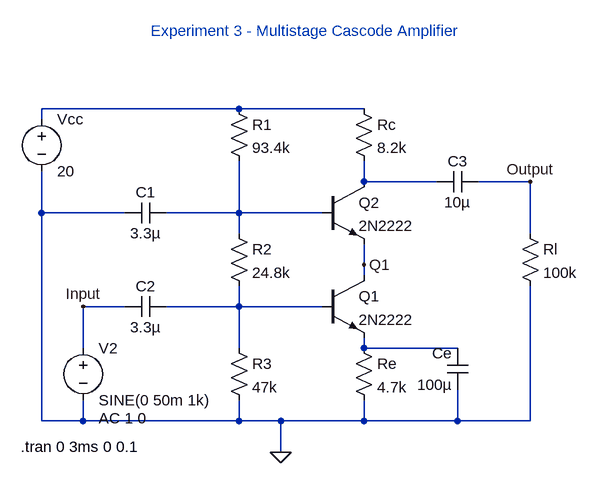
[diagram p0: schematic Experiment 3 - Multistage Cascode Amplifier.asc]
Experiment 3 - Multistage Cascode Amplifier.asc, the LTspice schematic file:
Version 4
SHEET 1 880 680
WIRE 64 -16 -240 -16
WIRE 256 -16 64 -16
WIRE -240 0 -240 -16
WIRE 256 96 256 64
WIRE 368 96 256 96
WIRE 512 96 432 96
WIRE -240 144 -240 80
WIRE -112 144 -240 144
WIRE 64 144 64 64
WIRE 64 144 -48 144
WIRE 192 144 64 144
WIRE 64 176 64 144
WIRE 512 176 512 96
WIRE 256 224 256 192
WIRE 256 240 256 224
WIRE -112 288 -176 288
WIRE 64 288 64 256
WIRE 64 288 -48 288
WIRE 192 288 64 288
WIRE -176 352 -176 288
WIRE 64 352 64 288
WIRE 256 352 256 336
WIRE 400 352 256 352
WIRE -240 464 -240 144
WIRE -176 464 -176 432
WIRE -176 464 -240 464
WIRE 64 464 64 432
WIRE 64 464 -176 464
WIRE 128 464 64 464
WIRE 256 464 256 432
WIRE 256 464 128 464
WIRE 400 464 400 416
WIRE 400 464 256 464
WIRE 512 464 512 256
WIRE 512 464 400 464
WIRE 128 512 128 464
FLAG 128 512 0
FLAG 512 96 Output
FLAG 256 224 Q1
FLAG -176 288 Input
SYMBOL npn 192 240 R0
SYMATTR InstName Q1
SYMATTR Value 2N2222
SYMBOL npn 192 96 R0
SYMATTR InstName Q2
SYMATTR Value 2N2222
SYMBOL res 48 -32 R0
SYMATTR InstName R1
SYMATTR Value 93.4k
SYMBOL res 48 160 R0
SYMATTR InstName R2
SYMATTR Value 24.8k
SYMBOL res 48 336 R0
SYMATTR InstName R3
SYMATTR Value 47k
SYMBOL res 240 -32 R0
SYMATTR InstName Rc
SYMATTR Value 8.2k
SYMBOL res 496 160 R0
SYMATTR InstName Rl
SYMATTR Value 100k
SYMBOL cap -48 128 R90
WINDOW 0 0 32 VBottom 2
WINDOW 3 32 32 VTop 2
SYMATTR InstName C1
SYMATTR Value 3.3µ
SYMBOL cap -48 272 R90
WINDOW 0 0 32 VBottom 2
WINDOW 3 32 32 VTop 2
SYMATTR InstName C2
SYMATTR Value 3.3µ
SYMBOL cap 432 80 R90
WINDOW 0 0 32 VBottom 2
WINDOW 3 32 32 VTop 2
SYMATTR InstName C3
SYMATTR Value 10µ
SYMBOL cap 416 416 R180
WINDOW 0 24 56 Left 2
WINDOW 3 24 8 Left 2
SYMATTR InstName Ce
SYMATTR Value 100µ
SYMBOL res 240 336 R0
SYMATTR InstName Re
SYMATTR Value 4.7k
SYMBOL voltage -240 -16 R0
WINDOW 123 0 0 Left 0
WINDOW 39 0 0 Left 0
SYMATTR InstName Vcc
SYMATTR Value 20
SYMBOL voltage -176 336 R0
WINDOW 123 24 124 Left 2
WINDOW 39 0 0 Left 0
SYMATTR Value2 AC 1 0
SYMATTR InstName V2
SYMATTR Value SINE(0 50m 1k)
TEXT -72 -136 Left 2 ;Experiment 3 - Multistage Cascode Amplifier
TEXT -272 504 Left 2 !.tran 0 3ms 0 0.1

The netlist it stands for:
* Experiment 3 - Multistage Cascode Amplifier.asc
Q1 Q1 N004 N005 0 2N2222
Q2 N002 N003 Q1 0 2N2222
R1 N001 N003 93.4k
R2 N003 N004 24.8k
R3 N004 0 47k
Rc N001 N002 8.2k
Rl Output 0 100k
C1 N003 0 3.3µ
C2 N004 Input 3.3µ
C3 Output N002 10µ
Ce 0 N005 100µ
Re N005 0 4.7k
Vcc N001 0 20
V2 Input 0 SINE(0 50m 1k) AC 1 0
.model NPN NPN
.model PNP PNP
.lib standard.bjt
* Experiment 3 - Multistage Cascode Amplifier
.tran 0 3ms 0 0.1
.backanno
.end